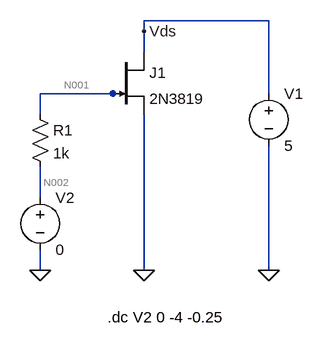
[diagram p0: schematic jfet transconductance characteristics.asc]
jfet transconductance characteristics.asc, the LTspice schematic file:
Version 4
SHEET 1 880 680
WIRE 384 -16 192 -16
WIRE 192 0 192 -16
WIRE 192 32 192 0
WIRE 144 96 32 96
WIRE 160 96 144 96
WIRE 384 96 384 -16
WIRE 32 128 32 96
WIRE 32 256 32 208
WIRE 32 368 32 336
WIRE 192 368 192 128
WIRE 384 368 384 176
FLAG 32 368 0
FLAG 192 368 0
FLAG 384 368 0
FLAG 192 0 Vds
SYMBOL njf 144 32 R0
SYMATTR InstName J1
SYMATTR Value 2N3819
SYMBOL voltage 384 80 R0
WINDOW 123 0 0 Left 0
WINDOW 39 0 0 Left 0
SYMATTR InstName V1
SYMATTR Value 5
SYMBOL voltage 32 240 R0
WINDOW 123 0 0 Left 0
WINDOW 39 0 0 Left 0
SYMATTR InstName V2
SYMATTR Value 0
SYMBOL res 16 112 R0
SYMATTR InstName R1
SYMATTR Value 1k
TEXT 136 440 Left 2 !.dc V2 0 -4 -0.25

The netlist it stands for:
* jfet transconductance characteristics.asc
J1 Vds N001 0 2N3819
V1 Vds 0 5
V2 N002 0 0
R1 N001 N002 1k
.model NJF NJF
.model PJF PJF
.lib standard.jft
.dc V2 0 -4 -0.25
.backanno
.end

* Results of the author's LTspice run, read from the files saved beside the schematic
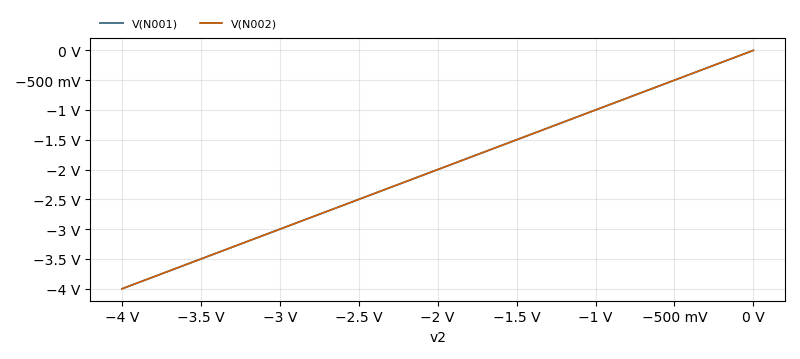
[diagram p1: DC transfer characteristic of jfet transconductance characteristics.asc, plotted from the saved traces]
* DC transfer characteristic, 1 run:
*   V(N001): 5.728 nV at v2=0 V, -4 V at v2=-4 V, min -4 V, max 5.728 nV
*   V(N002): 0 V at v2=0 V, -4 V at v2=-4 V, min -4 V, max 0 V